# Altium schematic sheet Power_Control.SchDoc
size A
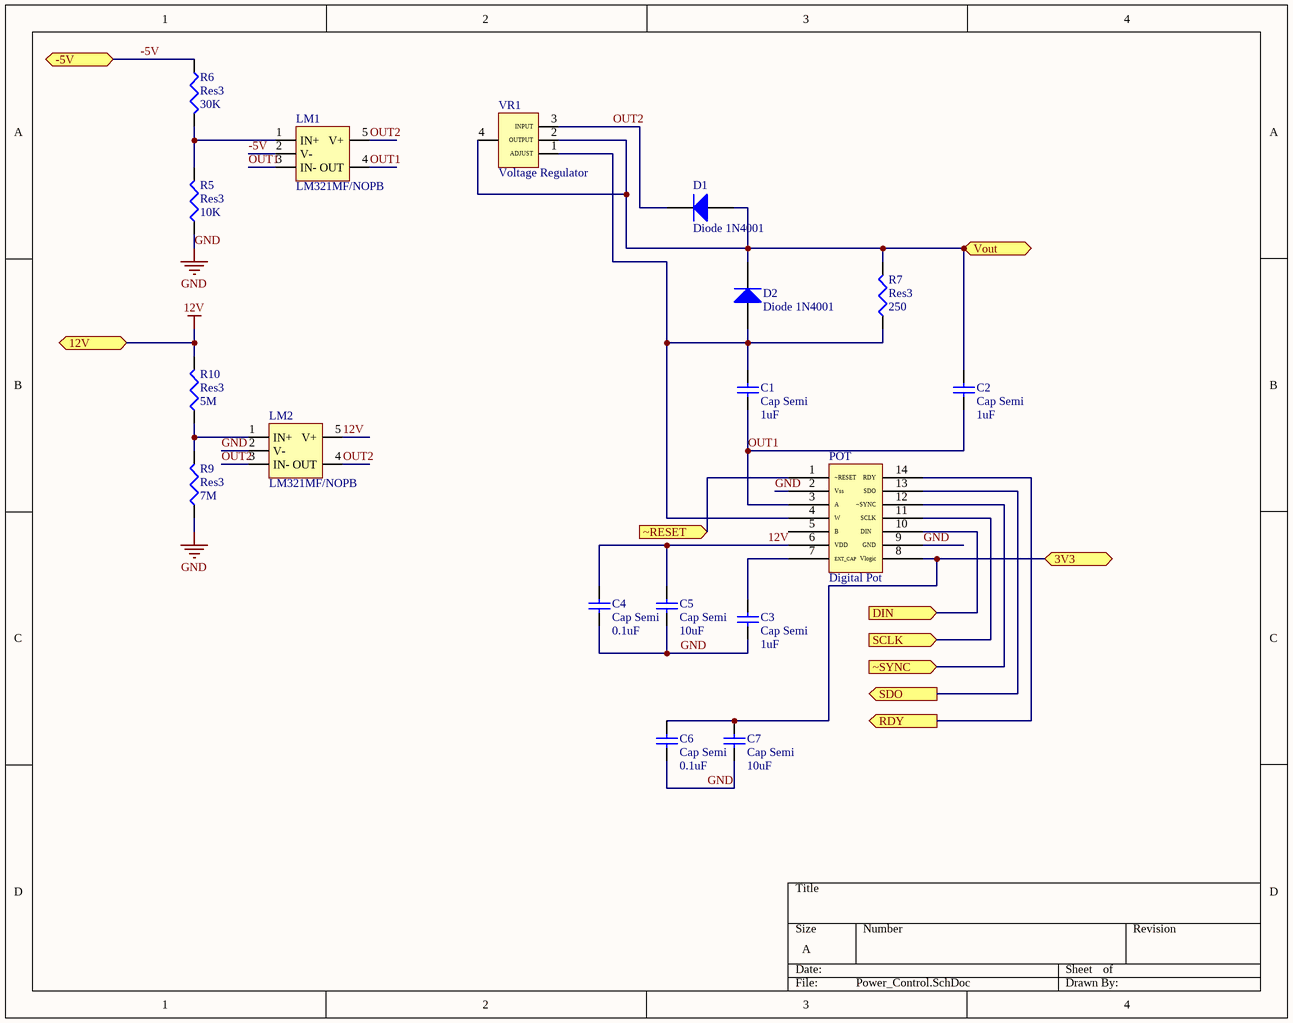
[diagram p0: Power_Control.SchDoc]

## Parts
C1  Cap Semi  value 1uF  [C1206]
C2  Cap Semi  value 1uF  [C1206]
C3  Cap Semi  value 1uF  [C1206]
C4  Cap Semi  value 0.1uF  [C1206]
C5  Cap Semi  value 10uF  [C1206]
C6  Cap Semi  value 0.1uF  [C1206]
C7  Cap Semi  value 10uF  [C1206]
D1  Diode 1N4001  [DO-41]
D2  Diode 1N4001  [DO-41]
LM1  LM321MF/NOPB
LM2  LM321MF/NOPB
POT  Digital Pot
R5  Res3  value 10K  [J1-0603]
R6  Res3  value 30K  [J1-0603]
R7  Res3  value 250  [J1-0603]
R9  Res3  value 7M  [J1-0603]
R10  Res3  value 5M  [J1-0603]
VR1  Voltage Regulator  [volt_reg]

## Ports
3V3 (bidir), 12V (bidir), -5V (bidir), DIN (in), RDY (out), SCLK (in), SDO (out), Vout (out), ~RESET (in), ~SYNC (in)

## Nets
12V: C4.2 C5.2 LM2.5(V+) POT.6(VDD) R10.2 ; port 12V
GND: C3.1 C4.1 C5.1 C6.1 C7.1 LM2.2(V-) POT.2(Vss) POT.9(GND) R5.1 R9.1
3V3: C6.2 C7.2 POT.8(Vlogic) ; port 3V3
-5V: LM1.2(V-) R6.1 ; port -5V
DIN: POT.10(DIN) ; port DIN
OUT1: C1.1 C2.1 LM1.3(IN-) LM1.4(OUT) POT.3(A)
OUT2: D1.2(K) LM1.5(V+) LM2.3(IN-) LM2.4(OUT) VR1.3(INPUT)
RDY: POT.14(RDY) ; port RDY
SCLK: POT.11(SCLK) ; port SCLK
SDO: POT.13(SDO) ; port SDO
Vout: C2.2 D1.1(A) D2.2(K) R7.2 VR1.2(OUTPUT) VR1.4(Output) ; port Vout
~RESET: POT.1(~RESET) ; port ~RESET
~SYNC: POT.12(~SYNC) ; port ~SYNC
NetC1_2: C1.2 D2.1(A) POT.4(W) R7.1 VR1.1(ADJUST)
NetC3_2: C3.2 POT.7(EXT_CAP)
NetLM1_1: LM1.1(IN+) R5.2 R6.2
NetLM2_1: LM2.1(IN+) R9.2 R10.1

Not connected (* = marked no-connect by the designer): POT 5(B)

## Library data of the parts
C1-C7 = Cap Semi: Capacitor (Semiconductor SIM Model); Published: 8-Jun-2000; LatestRevisionDate: 29-May-2009; LatestRevisionNote: IPC-7351 Footprint Added.; PackageReference: C1206; Publisher: Altium Limited; PackageDescription: Chip Capacitor
D1 D2 = Diode 1N4001: 1 Amp General Purpose Rectifier; Published: 8-Jun-2000; LatestRevisionDate: 17-Jul-2002; LatestRevisionNote: Re-released for DXP Platform.; DatasheetVersion: 1998; PackageVersion: Aug-1999; PackageReference: DO-41; Publisher: Altium Limited; PackageDescription: Diode, Axial; Body 5.2 x 2.7 mm (LxDia. max), Lead Dia. 0.86 mm (max); Code_JEDEC: DO-204-AL; ComponentLink1Description: Manufacturer Link; ComponentLink1URL: http://www.fairchildsemi.com/; ComponentLink2Description: Datasheet; ComponentLink2URL: http://www.fairchildsemi.com/ds/1N%2F1N4001.pdf
LM1 LM2 = LM321MF/NOPB: IC OPAMP GP 1MHZ SOT23-5; Manufacturer: Texas Instruments; Amplifier Type: General Purpose; Number of Circuits: 1; Slew Rate: 0.4 V/µs; Current - Input Bias: 45nA; Voltage - Input Offset: 2mV; Current - Supply: 660µA; Current - Output / Channel: 40mA; Voltage - Supply, Single/Dual (±): 3 V ~ 30 V, ±1.5 V ~ 15 V; Supplier 1: Digi-Key; Manufacturer Part Number: LM321MF/NOPB; RoHS: RoHS Compliant; Category: Integrated Circuits (ICs); Stock 1: 14679; Pricing 1: 1=0.67, 10=0.573, 100=0.4277, 500=0.33596 (USD); Packaging: Cut Tape (CT); Output Type: -; Gain Bandwidth Product: 1MHz; -3db Bandwidth: -; Operating Temperature: -40°C ~ 85°C; Mounting Type: Surface Mount; Package / Case: SC-74A, SOT-753; Supplier Device Package: SOT-23-5; ComponentLink1URL: http://www.ti.com/lit/ds/symlink/lm321.pdf; ComponentLink1Description: http://www.ti.com/lit/ds/symlink/lm321.pdf; Supplier Part Number 1: LM321MF/NOPBCT-ND
POT = Digital Pot: IC DGTL POT 1024POS 20K 14TSSOP; Manufacturer: Analog Devices Inc.; Manufacturer Part Number: AD5293BRUZ-20; Configuration: Potentiometer; Number of Circuits: 1; Number of Taps: 1024; Interface: SPI; Memory Type: Volatile; Voltage - Supply: 9 V ~ 33 V, ±9 V ~ 16.5 V; Tolerance: ±7%; Temperature Coefficient (Typ): 35 ppm/°C; Resistance - Wiper (Ohms) (Typ): 60; Supplier 1: Digi-Key; RoHS: RoHS Compliant; Category: Integrated Circuits (ICs); Stock 1: 271; Pricing 1: 1=6.13, 96=5.27771, 192=4.5826, 576=3.99047, 1056=3.47558, 2592=3.34685, 5000=3.252 (USD); Packaging: Tube; Taper: Linear; Resistance (Ohms): 20k; Features: -; Operating Temperature: -40°C ~ 105°C; Package / Case: 14-TSSOP (0.173", 4.40mm Width); Supplier Device Package: 14-TSSOP; ComponentLink1URL: http://www.analog.com/media/en/technical-documentation/data-sheets/AD5293.pdf; ComponentLink1Description: http://www.analog.com/media/en/technical-documentation/data-sheets/AD5293.pdf; Supplier Part Number 1: AD5293BRUZ-20-ND
R5-R7 R9 R10 = Res3: Resistor; Published: 8-Jun-2000; LatestRevisionDate: 29-May-2009; LatestRevisionNote: IPC-7351 Footprint Added.; PackageReference: J1-0603; Publisher: Altium Limited; PackageDescription: Chip Resistor
VR1 = Voltage Regulator: IC REG LDO ADJ 1.5A DDPAK; Manufacturer: Texas Instruments; Manufacturer Part Number: LM317KTTR; Regulator Topology: Positive Adjustable; Voltage - Output: 1.25 V ~ 37 V; Number of Regulators: 1; Voltage - Input: 4.2 V ~ 40 V; Supplier 1: Digi-Key; RoHS: RoHS Compliant; Category: Integrated Circuits (ICs); Stock 1: 23750; Pricing 1: 1=0.93, 10=0.816, 100=0.624 (USD); Packaging: Cut Tape (CT); Current - Output: 1.5A; Voltage - Dropout (Typical): -; Current - Limit (Min): -; Operating Temperature: 0°C ~ 125°C; Mounting Type: Surface Mount; Package / Case: TO-263-4, D²Pak (3 Leads + Tab), TO-263AA; Supplier Device Package: DDPAK/TO-263-3; ComponentLink1URL: http://www.ti.com/lit/ds/symlink/lm317.pdf; ComponentLink1Description: http://www.ti.com/lit/ds/symlink/lm317.pdf; Supplier Part Number 1: 296-21390-1-ND